# EAGLE design numitron-clock (EAGLE 9.6.2)
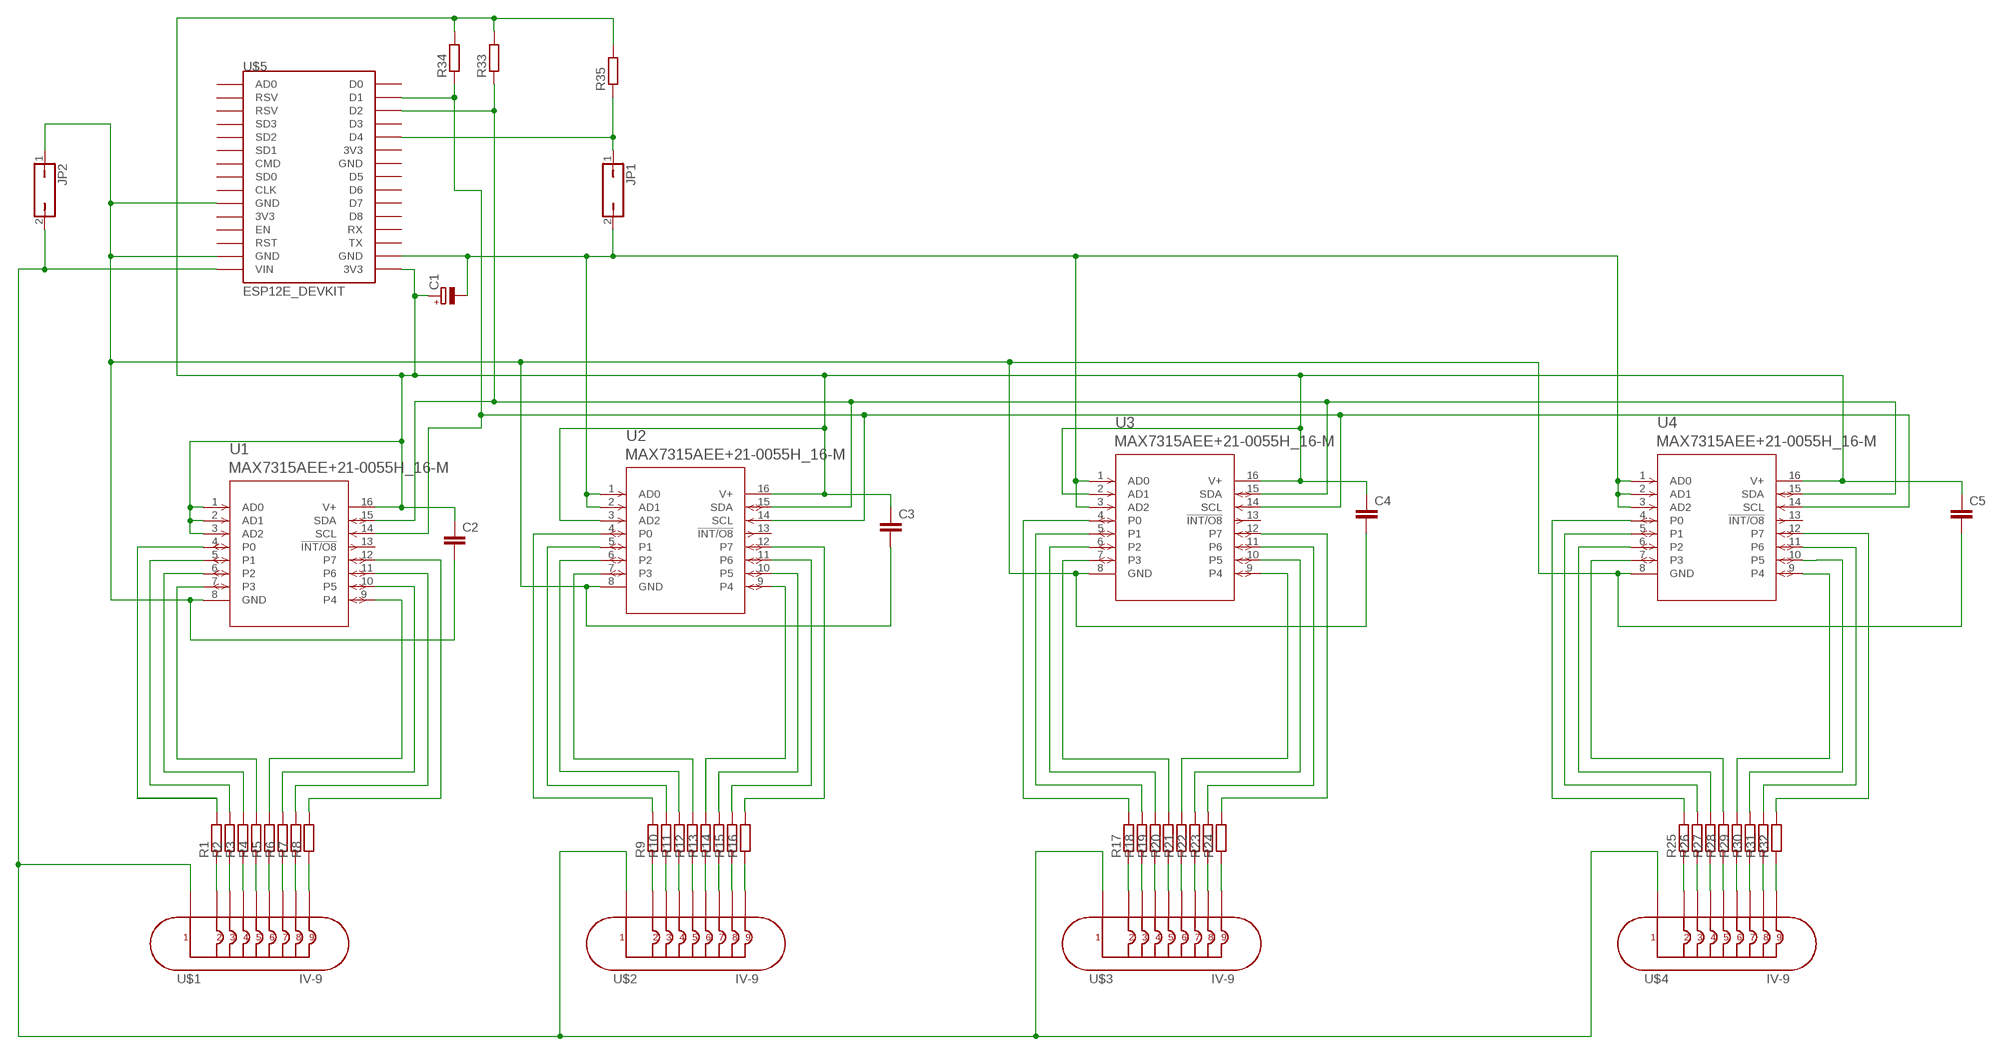
[diagram p0: schematic, sheet 1]

## Parts
C1  CPOL-EUE2,5-6E  [E2,5-6E]
C2  C-EUC0603  [C0603]
C3  C-EUC0603  [C0603]
C4  C-EUC0603  [C0603]
C5  C-EUC0603  [C0603]
JP1  JP1Q  [JP1]
JP2  JP1Q  [JP1]
R1  R-EU_R0603  [R0603]
R2  R-EU_R0603  [R0603]
R3  R-EU_R0603  [R0603]
R4  R-EU_R0603  [R0603]
R5  R-EU_R0603  [R0603]
R6  R-EU_R0603  [R0603]
R7  R-EU_R0603  [R0603]
R8  R-EU_R0603  [R0603]
R9  R-EU_R0603  [R0603]
R10  R-EU_R0603  [R0603]
R11  R-EU_R0603  [R0603]
R12  R-EU_R0603  [R0603]
R13  R-EU_R0603  [R0603]
R14  R-EU_R0603  [R0603]
R15  R-EU_R0603  [R0603]
R16  R-EU_R0603  [R0603]
R17  R-EU_R0603  [R0603]
R18  R-EU_R0603  [R0603]
R19  R-EU_R0603  [R0603]
R20  R-EU_R0603  [R0603]
R21  R-EU_R0603  [R0603]
R22  R-EU_R0603  [R0603]
R23  R-EU_R0603  [R0603]
R24  R-EU_R0603  [R0603]
R25  R-EU_R0603  [R0603]
R26  R-EU_R0603  [R0603]
R27  R-EU_R0603  [R0603]
R28  R-EU_R0603  [R0603]
R29  R-EU_R0603  [R0603]
R30  R-EU_R0603  [R0603]
R31  R-EU_R0603  [R0603]
R32  R-EU_R0603  [R0603]
R33  R-EU_R0603  [R0603]
R34  R-EU_R0603  [R0603]
R35  R-EU_R0603  [R0603]
U1  MAX7315AEE+21-0055H_16-M  [21-0055H_16-M]
U2  MAX7315AEE+21-0055H_16-M  [21-0055H_16-M]
U3  MAX7315AEE+21-0055H_16-M  [21-0055H_16-M]
U4  MAX7315AEE+21-0055H_16-M  [21-0055H_16-M]
U$1  IV-9  [IV-9]
U$2  IV-9  [IV-9]
U$3  IV-9  [IV-9]
U$4  IV-9  [IV-9]
U$5  ESP12E_DEVKIT  [ESP12E_DEVKIT]

## Nets
N$1 [Numitron]: R1.1 U$1.2
N$2 [Numitron]: R2.1 U$1.3
N$3 [Numitron]: R3.1 U$1.4
N$4 [Numitron]: R4.1 U$1.5
N$5 [Numitron]: R5.1 U$1.6
N$6 [Numitron]: R6.1 U$1.7
N$7 [Numitron]: R7.1 U$1.8
N$8 [Numitron]: R8.1 U$1.9
N$9: R1.2 U1.4(P0)
N$11: R33.1 U1.15(SDA) U2.15(SDA) U3.15(SDA) U4.15(SDA) U$5.D2
N$12: R34.1 U1.14(SCL) U2.14(SCL) U3.14(SCL) U4.14(SCL) U$5.D1
N$13 [Numitron]: R2.2 U1.5(P1)
N$14 [V+]: JP2.2 U$1.1 U$2.1 U$3.1 U$4.1 U$5.VIN
N$15 [Numitron]: R3.2 U1.6(P2)
N$16 [Numitron]: R4.2 U1.7(P3)
N$17 [Numitron]: R5.2 U1.9(P4)
N$18 [V+ MAX]: C1.+ C2.1 C3.1 C4.1 C5.1 R33.2 R34.2 R35.2 U1.1(AD0) U1.2(AD1) U1.3(AD2) U1.16(V+) U2.3(AD2) U2.16(V+) U3.2(AD1) U3.16(V+) U4.16(V+) U$5.3V3@2(3V3)
N$19 [Numitron]: R6.2 U1.10(P5)
N$20 [Numitron]: R7.2 U1.11(P6)
N$21 [Numitron]: R8.2 U1.12(P7)
N$22 [Numitron]: R12.2 U2.7(P3)
N$23 [Numitron]: R11.2 U2.6(P2)
N$24 [Numitron]: R10.2 U2.5(P1)
N$25 [Numitron]: R9.2 U2.4(P0)
N$26 [Numitron]: R13.2 U2.9(P4)
N$27 [Numitron]: R14.2 U2.10(P5)
N$28 [Numitron]: R15.2 U2.11(P6)
N$29 [Numitron]: R16.2 U2.12(P7)
N$30 [Numitron]: R17.2 U3.4(P0)
N$31 [Numitron]: R18.2 U3.5(P1)
N$32 [Numitron]: R19.2 U3.6(P2)
N$33 [Numitron]: R20.2 U3.7(P3)
N$34 [Numitron]: R21.2 U3.9(P4)
N$35 [Numitron]: R22.2 U3.10(P5)
N$36 [Numitron]: R23.2 U3.11(P6)
N$37 [Numitron]: R24.2 U3.12(P7)
N$38 [Numitron]: R25.2 U4.4(P0)
N$39 [Numitron]: R26.2 U4.5(P1)
N$40 [Numitron]: R27.2 U4.6(P2)
N$41 [Numitron]: R28.2 U4.7(P3)
N$42 [Numitron]: R29.2 U4.9(P4)
N$43 [Numitron]: R30.2 U4.10(P5)
N$44 [Numitron]: R31.2 U4.11(P6)
N$45 [Numitron]: R32.2 U4.12(P7)
N$46: JP1.1 R35.1 U$5.D4
N$48 [GND]: C2.2 C3.2 C4.2 C5.2 JP2.1 U1.8(GND) U2.8(GND) U3.8(GND) U4.8(GND) U$5.GND@0(GND) U$5.GND@1(GND)
N$50: C1.- JP1.2 U2.1(AD0) U2.2(AD1) U3.1(AD0) U3.3(AD2) U4.1(AD0) U4.2(AD1) U4.3(AD2) U$5.GND@3(GND)
N$51 [Numitron]: R25.1 U$4.2
N$52 [Numitron]: R26.1 U$4.3
N$53 [Numitron]: R27.1 U$4.4
N$54 [Numitron]: R28.1 U$4.5
N$55 [Numitron]: R29.1 U$4.6
N$56 [Numitron]: R30.1 U$4.7
N$57 [Numitron]: R31.1 U$4.8
N$58 [Numitron]: R32.1 U$4.9
N$59 [Numitron]: R17.1 U$3.2
N$60 [Numitron]: R18.1 U$3.3
N$61 [Numitron]: R19.1 U$3.4
N$62 [Numitron]: R20.1 U$3.5
N$63 [Numitron]: R21.1 U$3.6
N$64 [Numitron]: R22.1 U$3.7
N$65 [Numitron]: R23.1 U$3.8
N$66 [Numitron]: R24.1 U$3.9
N$67 [Numitron]: R9.1 U$2.2
N$68 [Numitron]: R10.1 U$2.3
N$69 [Numitron]: R11.1 U$2.4
N$70 [Numitron]: R12.1 U$2.5
N$71 [Numitron]: R13.1 U$2.6
N$72 [Numitron]: R14.1 U$2.7
N$73 [Numitron]: R15.1 U$2.8
N$74 [Numitron]: R16.1 U$2.9
Unconnected: U1.13(!INT/O8) U2.13(!INT/O8) U3.13(!INT/O8) U4.13(!INT/O8) U$5.3V3@0(3V3) U$5.3V3@1(3V3) U$5.AD0 U$5.CLK U$5.CMD U$5.D0 U$5.D3 U$5.D5 U$5.D6 U$5.D7 U$5.D8 U$5.EN U$5.GND@2(GND) U$5.RST U$5.RSV@0(RSV) U$5.RSV@1(RSV) U$5.RX U$5.SD0 U$5.SD1 U$5.SD2 U$5.SD3 U$5.TX

## Library data of the parts
C1 = rcl:CPOL-EU: POLARIZED CAPACITOR, European symbol; SPICEPREFIX: C
C2-C5 = rcl:C-EU: CAPACITOR, European symbol; SPICEPREFIX: C
JP1 JP2 = jumper:JP1Q: JUMPER
R1-R35 = rcl:R-EU_: RESISTOR, European symbol; SPICEPREFIX: R
U1-U4 = MAX7315:MAX7315AEE+; COPYRIGHT: Copyright (C) 2024 Ultra Librarian. All rights reserved.; MANUFACTURER_PART_NUMBER: MAX7315AEE+; MFR_NAME: Analog Devices Inc
U$1-U$4 = domestichacks:IV-9
U$5 = ESP12E_DEVKIT:ESP12E_DEVKIT: ESP12E DEVKIT BOARD

## Net classes
0 default: width 0.3 mm
1 V+: width 0.6 mm
2 Numitron: width 0.3 mm
3 GND: width 0.6 mm
4 V+ MAX: width 0.3 mm

## Board
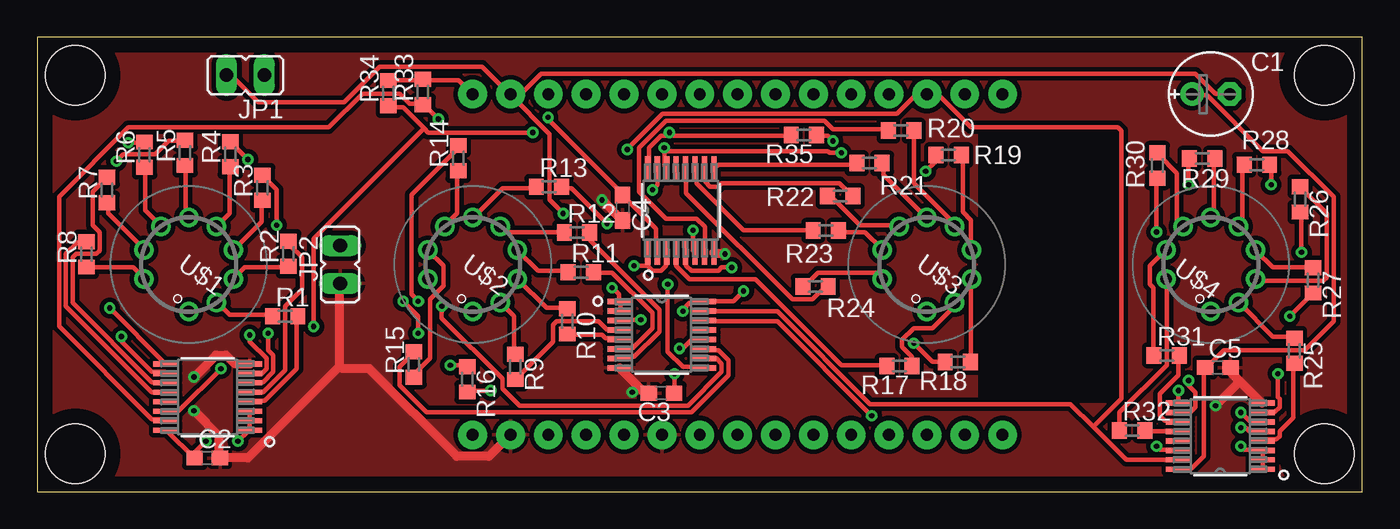
[diagram p1: board, top side]
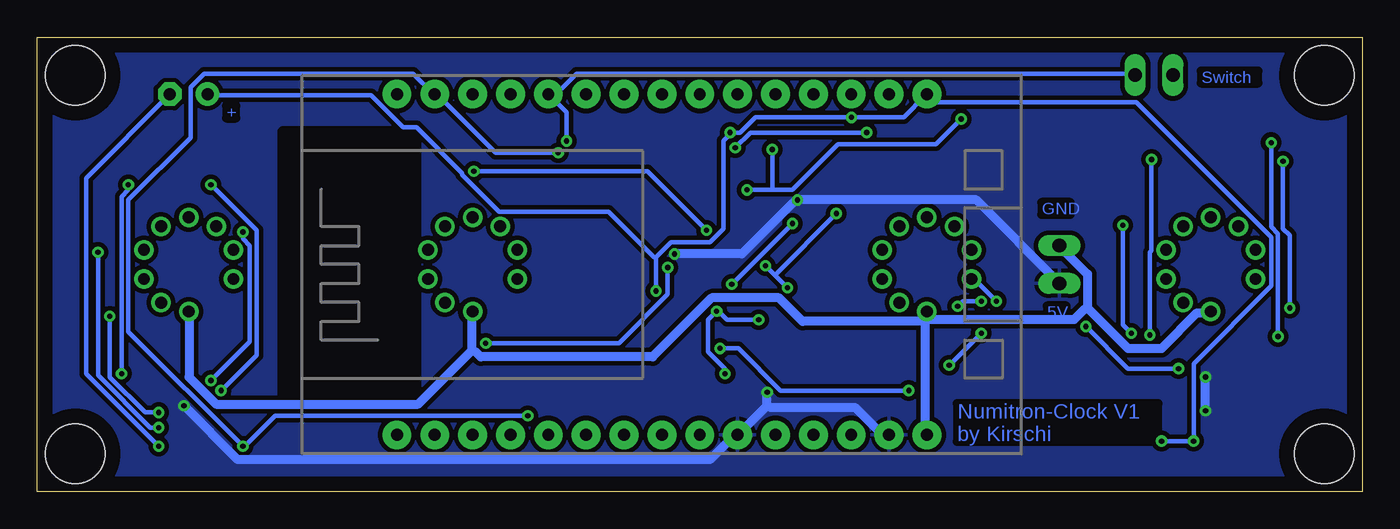
[diagram p2: board, bottom side, seen from below]

Size 88.9 x 30.48 mm. Coordinates in mm from the lower left corner, seen from the top.
Outline: 0,0 88.9,0 88.9,30.48 0,30.47 0,0
Copper layers (1*16): Top 0.035mm / dielectric 1.5mm / Bottom 0.035mm
Design rules "default": minimum track width 6mil, minimum drill 0.35mm, track to track 6mil, track to pad 6mil, pad to pad 6mil, via to via 6mil, smd to smd 6mil, copper to edge 40mil, drill to drill 6mil, minimum pad ring 10mil, minimum via ring 8mil, stop-mask expansion 4mil, vias tented up to drill 0mil, thermal gap 10mil
Holes 4 mm at 2.54,2.54 2.54,27.94 86.36,27.94 86.36,2.54
tRestrict: area 63.5,6.3 to 72.4,24.1
bRestrict: area 63.5,6.3 to 72.4,24.1

### Footprints (pad centres in the part's own frame; a part is rotated, then mirrored left to right if it is on the bottom)
E2,5-6E = drill 0.813 pad 1.575: + -1.27,0 | drill 0.813 pad 1.575 octagon: - 1.27,0
C0603 = smd 1.1 x 1: 1 -0.85,0; 2 0.85,0
JP1 = drill 0.914 long: 1 0,-1.27; 2 0,1.27
R0603 = smd 1 x 1.1: 1 -0.85,0; 2 0.85,0
21-0055H_16-M = smd 1.655 x 0.355: 1 -2.821,2.223; 2 -2.821,1.587; 3 -2.821,0.953; 4 -2.821,0.318; 5 -2.821,-0.318; 6 -2.821,-0.953; 7 -2.821,-1.587; 8 -2.821,-2.223; 9 2.821,-2.223; 10 2.821,-1.587; 11 2.821,-0.953; 12 2.821,-0.318; 13 2.821,0.318; 14 2.821,0.953; 15 2.821,1.587; 16 2.821,2.223
IV-9 = drill 0.8: 1 1.854,-2.552; 2 3,-0.975; 3 3,0.975; 4 1.854,2.552; 5 0,3.154; 6 -1.854,2.552; 7 -3,0.975; 8 -3,-0.975; 9 -1.854,-2.552
ESP12E_DEVKIT = drill 0.8 pad 1.93: 3V3@0 -11.43,-7.62; 3V3@1 11.43,5.08; 3V3@2 11.43,-17.78; AD0 -11.43,17.78; CLK -11.43,-2.54; CMD -11.43,2.54; D0 11.43,17.78; D1 11.43,15.24; D2 11.43,12.7; D3 11.43,10.16; D4 11.43,7.62; D5 11.43,0; D6 11.43,-2.54; D7 11.43,-5.08; D8 11.43,-7.62; EN -11.43,-10.16; GND@0 -11.43,-5.08; GND@1 -11.43,-15.24; GND@2 11.43,2.54; GND@3 11.43,-15.24; RST -11.43,-12.7; RSV@0 -11.43,15.24; RSV@1 -11.43,12.7; RX 11.43,-10.16; SD0 -11.43,0; SD1 -11.43,5.08; SD2 -11.43,7.62; SD3 -11.43,10.16; TX 11.43,-12.7; VIN -11.43,-17.78

### Placement (x,y rotation side)
C1  78.74,26.67 0 top
C2  11.41,2.26 0 top
C3  41.88,6.62 180 top
C4  39.28,19.05 270 top
C5  79.21,8.33 0 top
JP1  13.97,27.94 90 top
JP2  20.32,15.24 0 top
R1  16.64,11.77 0 top
R2  16.86,15.96 90 top
R3  15.11,20.39 90 top
R4  12.95,22.63 90 top
R5  9.92,22.73 90 top
R6  7.2,22.6 90 top
R7  4.69,20.24 90 top
R8  3.29,15.92 90 top
R9  32.08,8.38 270 top
R10  35.56,11.43 270 top
R11  36.48,14.72 0 top
R12  36.21,17.39 0 top
R13  34.34,20.45 0 top
R14  28.24,22.37 90 top
R15  25.27,8.53 90 top
R16  28.84,7.54 270 top
R17  57.85,8.42 180 top
R18  61.77,8.7 180 top
R19  61.15,22.58 180 top
R20  57.96,24.22 180 top
R21  55.84,22.04 180 top
R22  53.87,19.83 0 top
R23  52.91,17.52 180 top
R24  52.22,13.77 0 top
R25  84.34,9.45 270 top
R26  84.73,19.61 270 top
R27  85.61,14.18 270 top
R28  81.83,21.93 0 top
R29  78.16,22.35 180 top
R30  75.15,21.88 270 top
R31  75.78,9.14 0 top
R32  73.46,4.11 0 top
R33  25.88,26.81 90 top
R34  23.57,26.73 90 top
R35  51.44,23.92 180 top
U1  11.43,6.35 180 top
U2  41.9,10.53 0 top
U3  43.18,18.87 90 top
U4  79.37,3.73 180 top
U$1  10.16,15.24 324 top
U$2  29.21,15.24 324 top
U$3  59.69,15.24 324 top
U$4  78.74,15.24 324 top
U$5  46.99,15.24 90 bottom

### Tracks (layer width: path | path; a pad name or v marks a point on that pad's centre or on a via)
N$1
  Top 0.3: R1.1 15.72,11.88 12.89,11.88 12.1,12.67 U$1.2
N$2
  Top 0.3: R2.1 16.85,15.04 13.91,15.04 13.23,14.36 U$1.3
N$3
  Top 0.3: R3.1 15.04,19.45 15.04,18.1 13.23,16.29 U$1.4
N$4
  Top 0.3: R4.1 12.89,21.71 12.89,18.66 12.1,17.87 U$1.5
N$5
  Top 0.3: R5.1 9.95,21.83 9.95,18.55 10.07,18.43 U$1.6
N$6
  Top 0.3: R6.1 7.24,21.71 7.24,18.89 8.26,17.87 U$1.7
N$7
  Top 0.3: R7.1 4.75,19.34 4.75,18.66 7.12,16.29 U$1.8
N$8
  Top 0.3: R8.1 3.39,15.04 6.45,15.04 7.12,14.36 U$1.9
N$9
  Top 0.3: R1.2 17.42,11.76 17.42,8.26 15.27,6.11 14.36,6.11 U1.4
N$11  (via drill 0.35)
  Top 0.3: 70.86,4.35 73.06,2.15 76.46,2.15 U4.15 | 70.86,4.35 69.33,5.88 55.87,5.88 49.65,12.1 44.79,12.1 U2.15 | 70.86,4.35 72.72,6.22 72.72,24.2 72.5,24.43 62.66,24.43 60.51,26.58 59.72,26.58 U$5.D2 59.6,26.58 58.92,26.58 57.68,25.33 41.96,25.33 v39.59,22.96 | U1.15 8.6,4.86 7.69,4.86 1.47,11.08 1.47,19.79 6.11,24.43 19.57,24.43 21.83,26.69 24.32,26.69 25,26.01 25.79,26.01 R33.1 26.01,25.9 v26.92,25 | v41.28,20.25 41.62,20.58 41.62,21.6 U3.15
  Bottom 0.3: 39.59,20.25 38.23,20.25 35.17,23.3 28.61,23.3 v26.92,25 | 39.59,20.25 v41.28,20.25 | 39.59,20.25 v39.59,22.96
N$12  (via drill 0.35)
  Top 0.3: 25.96,24.37 26.24,24.09 v33.25,24.09 | 25.96,24.37 24.54,25.79 23.64,25.79 R34.1 | U3.14 42.19,21.71 42.07,21.83 v42.07,23.07 42.19,22.85 53.04,22.85 53.16,22.73 v53.95,22.73 | v12.33,8.26 9.5,5.43 8.71,5.43 U1.14 | v18.55,11.08 18.55,16.96 25.96,24.37 | v75.1,3.05 75.33,2.83 76.46,2.83 U4.14 | v55.98,5.09 49.65,11.42 44.79,11.42 U2.14
  Bottom 0.3: v33.25,24.09 41.05,24.09 v42.07,23.07 | v12.33,8.26 15.72,8.26 v18.55,11.08 | v55.98,5.09 72.95,5.09 74.98,3.05 v75.1,3.05 82.79,10.74 82.79,19.57 78.61,23.75 78.61,27.14 77.7,28.05 63.67,28.05 62.32,26.69 U$5.D1 62.09,26.69 58.13,22.73 v53.95,22.73
N$13
  Top 0.3: R2.2 16.96,16.74 16.96,16.51 17.76,15.72 17.76,13.57 16.63,12.44 16.63,8.14 15.15,6.67 14.36,6.67 U1.5
N$14
  Bottom 0.6: 59.72,9.5 59.72,11.99 U$3.1 | 59.72,9.5 63.34,5.88 76.91,5.88 78.72,7.69 78.72,11.99 U$4.1 | 29.29,11.42 29.29,3.85 U$5.VIN | 29.29,11.42 29.29,11.99 U$2.1 29.07,11.54 19.34,11.54 18.66,12.21 18.43,12.33 | 18.43,12.33 15.72,9.61 13.46,9.61 11.08,11.99 10.18,11.99 U$1.1 | 18.43,12.33 18.43,14.59 20.25,16.4 JP2.2 | 29.29,11.42 37.55,11.42 39.13,13.01 43.66,13.01 47.62,9.05 59.15,9.05 59.49,9.39 59.72,9.5
N$15  (via drill 0.35)
  Top 0.3: v16.06,17.87 16.06,20.25 15.15,21.15 R3.2 | v15.49,10.63 15.49,9.5 15.83,9.16 15.83,8.03 15.15,7.35 14.36,7.35 U1.6
  Bottom 0.3: v16.06,17.87 16.06,11.2 v15.49,10.63
N$16  (via drill 0.35)
  Top 0.3: v14.14,22.28 13.01,23.41 R4.2 | v14.25,10.52 14.25,10.07 15.38,8.94 15.38,8.26 15.04,7.92 14.36,7.92 U1.7
  Bottom 0.3: v14.14,22.28 14.14,16.17 14.25,16.06 v14.25,10.52
N$17  (via drill 0.35)
  Top 0.3: v5.32,22.17 5.77,22.62 7.92,22.62 8.82,23.52 9.84,23.52 R5.2 | v4.86,12.33 8.6,8.6 U1.9
  Bottom 0.3: v5.32,22.17 5.32,17.64 4.86,17.19 v4.86,12.33
N$18  (via drill 0.35)
  Top 0.3: U4.16 76.57,1.58 77.47,1.58 78.27,2.38 78.27,8.26 C5.1 78.49,8.37 79.62,9.5 85.05,9.5 86.97,11.42 86.97,19.79 83.92,22.85 82.22,22.85 78.49,26.58 77.47,26.58 C1.+ | v42.75,7.92 42.75,6.67 C3.1 | v43.32,12.1 43.54,12.33 43.54,12.44 43.77,12.67 44.67,12.67 U2.16 44.79,12.78 46.71,12.78 v47.39,13.46 | v40.49,11.54 39.13,11.54 U2.3 | 42.41,23.86 41.85,23.86 41.05,23.07 41.05,21.71 U3.16 | 42.41,23.86 50.56,23.86 R35.2 | U1.3 14.25,5.32 14.25,4.86 U1.2 14.25,4.18 U1.1 14.14,4.07 v13.46,3.39 | U1.16 8.71,4.07 10.52,2.26 C2.1 10.4,2.49 v11.31,3.39 | U3.2 41.51,16.06 41.51,17.64 39.36,19.79 C4.1 39.25,20.02 34.27,25 v34.27,25.11 | R34.2 23.64,27.6 25.79,27.6 R33.2 26.01,27.6 28.27,27.6 29.18,26.69 U$5.3V3@2 | v42.41,24.09 42.41,23.86
  Bottom 0.3: v42.75,7.92 42.75,8.26 43.88,9.39 43.88,11.54 v43.32,12.1 43.2,12.1 42.64,11.54 v40.49,11.54 | v13.46,3.39 v11.31,3.39 11.31,8.6 6.11,13.8 6.11,17.08 15.15,26.13 28.5,26.13 29.07,26.69 U$5.3V3@2 29.29,26.58 30.76,25.11 v34.27,25.11 40.72,25.11 41.73,24.09 v42.41,24.09 42.41,23.98 42.87,23.52 42.87,17.64 43.77,16.74 46.37,16.74 47.39,15.72 | 47.39,15.72 v47.39,13.46 | C1.+ 77.36,26.58 66.5,26.58 64.35,24.43 63.45,24.43 60.4,21.38 60.4,21.26 57.91,18.77 50.56,18.77 47.5,15.72 47.39,15.72
N$19  (via drill 0.35)
  Top 0.3: v6.11,23.41 7.12,23.41 R6.2 | v5.66,10.4 5.66,10.07 7.69,8.03 8.6,8.03 U1.10
  Bottom 0.3: v6.11,23.41 6.11,17.76 5.66,17.3 v5.66,10.4
N$20
  Top 0.3: R7.2 4.64,21.04 3.73,20.13 3.73,17.87 4.18,17.42 4.18,16.17 3.96,15.95 2.6,15.95 2.38,15.72 2.38,12.67 7.69,7.35 8.6,7.35 U1.11
N$21
  Top 0.3: R8.2 3.28,16.74 2.71,16.74 1.92,15.95 1.92,12.44 7.69,6.67 8.6,6.67 U1.12
N$22
  Top 0.3: R12.2 37.1,17.3 37.1,16.85 41.73,12.21 41.73,10.74 40.04,9.05 39.13,9.05 U2.7
N$23
  Top 0.3: R11.2 37.44,14.7 38.57,14.7 41.28,11.99 41.28,10.97 39.92,9.61 39.13,9.61 U2.6
N$24
  Top 0.3: R10.2 35.63,10.52 37.89,10.52 38.12,10.29 39.02,10.29 U2.5
N$25
  Top 0.3: R9.2 32.12,7.58 34.61,10.07 34.61,11.2 34.84,11.42 37.66,11.42 38.23,10.86 39.02,10.86 U2.4
N$26  (via drill 0.35)
  Top 0.3: v38.23,17.98 35.85,20.36 35.29,20.36 R13.2 | v42.3,13.91 42.3,9.39 43.32,8.37 44.67,8.37 U2.9
  Bottom 0.3: v42.3,13.91 v38.23,17.98
N$27  (via drill 0.35)
  Top 0.3: v25.56,12.78 25.11,13.23 25.11,19.91 28.16,22.96 28.16,23.19 R14.2 | v27.14,12.44 27.14,11.65 31.22,7.58 31.22,6.9 32.35,5.77 43.66,5.77 45.92,8.03 45.92,8.6 45.58,8.94 44.79,8.94 U2.10
  Bottom 0.3: v25.56,12.78 26.8,12.78 v27.14,12.44
N$28
  Top 0.3: R15.2 25.22,9.27 24.32,8.37 24.32,7.12 26.13,5.32 43.88,5.32 46.37,7.8 46.37,8.82 45.69,9.5 44.79,9.5 U2.11
N$29  (via drill 0.35)
  Top 0.3: v30.42,6.79 28.95,6.79 R16.2 | v43.09,9.61 43.32,9.61 43.88,10.18 44.67,10.18 U2.12
  Bottom 0.3: v30.42,6.79 39.02,6.79 41.85,9.61 v43.09,9.61
N$30
  Top 0.3: R17.2 56.89,8.48 53.95,8.48 48.18,14.25 43.77,14.25 42.87,15.15 42.87,15.95 U3.4
N$31  (via drill 0.35)
  Top 0.3: v58.81,9.95 60.06,8.71 60.85,8.71 R18.2 | v46.6,15.04 45.92,15.04 45.69,14.82 43.88,14.82 43.54,15.15 43.54,15.95 U3.5
  Bottom 0.3: v58.81,9.95 49.88,9.95 46.6,13.23 v46.6,15.04
N$32  (via drill 0.35)
  Top 0.3: v59.6,21.49 60.28,22.17 60.28,22.51 R19.2 | v44,17.53 44,16.17 44.11,16.06 U3.6
  Bottom 0.3: v59.6,21.49 47.95,21.49 v44,17.53
N$33
  Top 0.3: R20.2 57,24.32 53.38,24.32 52.82,24.88 42.19,24.88 40.38,23.07 40.38,20.13 42.19,18.32 44.22,18.32 44.79,17.76 44.79,16.06 U3.7
N$34
  Top 0.3: R21.2 54.97,21.94 45.69,21.94 45.47,21.71 U3.9
N$35
  Top 0.3: R22.2 54.63,19.91 53.84,20.7 45.92,20.7 45.69,20.47 45.13,20.47 44.79,20.81 44.79,21.6 U3.10
N$36
  Top 0.3: R23.2 52.03,17.53 47.39,17.53 44.22,20.7 44.22,21.6 U3.11
N$37
  Top 0.3: R24.2 53.04,13.69 52.82,13.69 52.03,12.89 50.67,12.89 43.54,20.02 43.54,21.6 U3.12
N$38
  Top 0.3: R25.2 84.26,8.6 84.26,4.98 83.36,4.07 83.36,3.73 83.13,3.51 82.22,3.51 U4.4
N$39  (via drill 0.35)
  Top 0.3: v84.83,16.06 84.83,18.66 R26.2 | v80.75,4.3 81.09,4.3 81.32,4.07 82.11,4.07 U4.5
  Bottom 0.3: v84.83,16.06 84.83,7.8 81.32,4.3 v80.75,4.3
N$40  (via drill 0.35)
  Top 0.3: v84.03,11.76 85.5,13.23 R27.2 | v80.75,5.32 81.32,4.75 82.11,4.75 U4.6
  Bottom 0.3: v84.03,11.76 84.03,7.69 81.66,5.32 v80.75,5.32
N$41  (via drill 0.35)
  Top 0.3: v82.79,20.58 82.79,21.83 R28.2 | v83.24,7.92 83.24,6.33 83.36,6.22 83.36,5.66 83.02,5.32 82.22,5.32 U4.7
  Bottom 0.3: v82.79,20.58 82.79,20.25 83.24,19.79 v83.24,7.92
N$42  (via drill 0.35)
  Top 0.3: v77.25,20.58 77.25,22.28 R29.2 | v76.57,6.79 76.57,5.99 U4.9
  Bottom 0.3: v77.25,20.58 74.19,17.53 74.19,9.16 v76.57,6.79
N$43  (via drill 0.35)
  Top 0.3: v75.1,17.42 75.1,20.92 R30.2 | v77.25,7.46 77.25,7.12 77.7,6.67 77.7,5.66 77.36,5.32 76.57,5.32 U4.10
  Bottom 0.3: v75.1,17.42 75.1,16.96 74.65,16.51 74.65,10.07 v77.25,7.46
N$44
  Top 0.3: R31.2 76.57,9.05 76.57,7.8 75.33,6.56 75.33,5.09 75.66,4.75 76.46,4.75 U4.11
N$45
  Top 0.3: R32.2 74.42,4.07 76.46,4.07 U4.12
N$46  (via drill 0.35)
  Top 0.3: v53.38,23.52 53.04,23.86 52.37,23.86 R35.1
  Bottom 0.3: v53.38,23.52 53.38,25.45 54.51,26.58 U$5.D4 54.29,26.46 52.7,28.05 15.27,28.05 JP1.1
N$48  (via drill 0.35)
  Top 0.6: 20.25,8.37 14.14,2.26 12.33,2.26 C2.2 12.21,2.49 12.21,3.73 v10.52,5.43 | 20.25,8.37 20.25,13.91 JP2.1 | v37.89,19.57 39.25,18.21 C4.2 | v10.52,7.69 11.99,9.16 12.67,9.16 13.23,8.6 14.25,8.6 U1.8 | v46.15,15.95 45.47,15.95 U3.8 | 80.7,7.41 82.11,5.99 U4.8 | 80.7,7.41 80.08,8.03 80.08,8.26 C5.2 | 40.32,7.07 39.13,8.26 U2.8 | 40.32,7.07 40.72,6.67 40.94,6.67 C3.2 | v39.92,6.67 40.32,7.07 | v79.06,5.77 80.7,7.41 | 20.25,8.37 20.47,8.26 22.28,8.26 28.16,2.38 30.31,2.38 31.67,3.73 U$5.GND@1
  Bottom 0.6: JP2.1 20.36,14.02 25.9,19.57 v37.89,19.57 38.12,19.45 41.62,15.95 v46.15,15.95 | v10.52,5.43 v10.52,7.69 | 39.92,5.77 v39.92,6.67 | 39.92,5.77 41.85,3.85 U$5.GND@0 42.19,3.73 43.77,2.15 75.44,2.15 v79.06,5.77 | U$5.GND@1 31.78,3.85 32.23,3.85 34.04,5.66 39.7,5.66 39.92,5.77
  pour Top (isolate 0.305): 0,30.48 0,0 88.9,0 88.9,30.48
  pour Bottom (isolate 0.305): 0,0 0,30.48 88.9,30.48 88.9,0
N$50  (via drill 0.35)
  Top 0.3: U4.1 82.22,1.58 82.22,2.04 U4.2 82.22,2.26 82.22,2.71 U4.3 82.11,2.83 80.98,2.83 v80.75,3.05 | U2.2 39.13,12.21 39.13,12.67 U2.1 39.02,12.89 39.02,13.23 v38.57,13.69 | 40.94,15.15 40.94,15.95 U3.1 | 40.94,15.15 41.28,14.82 41.85,14.82 42.19,15.15 42.19,15.95 U3.3 | 40.94,15.15 v40.04,15.15 | JP1.2 12.78,27.94 13.01,27.94 14.82,26.13 20.58,26.13 22.96,28.5 29.86,28.5 31.67,26.69 U$5.GND@3 | v35.29,18.66 34.38,19.57 34.38,23.98 31.78,26.58 U$5.GND@3 | C1.- 79.96,26.69 79.06,26.69 77.7,28.05 33.82,28.05 32.12,26.35 U$5.GND@3
  Bottom 0.3: v80.75,3.05 85.62,7.92 85.62,21.04 80.08,26.58 C1.- | v40.04,15.15 39.41,14.53 | 39.41,14.53 v38.57,13.69 | v35.29,18.66 39.41,14.53
N$51
  Top 0.3: R25.1 84.26,10.4 82.9,10.4 80.64,12.67 U$4.2
N$52
  Top 0.3: R26.1 84.83,20.36 86.52,18.66 86.52,14.36 86.3,14.14 81.88,14.14 81.77,14.25 U$4.3
N$53
  Top 0.3: R27.1 85.5,15.04 82.9,15.04 81.77,16.17 U$4.4
N$54
  Top 0.3: R28.1 80.87,21.83 80.87,18.1 80.64,17.87 U$4.5
N$55
  Top 0.3: R29.1 78.94,22.28 78.94,18.55 78.83,18.43 U$4.6
N$56
  Top 0.3: R30.1 75.21,22.62 76.46,21.38 76.46,18.21 76.8,17.87 U$4.7
N$57
  Top 0.3: R31.1 74.87,9.16 74.87,13.69 74.65,13.91 74.65,15.15 75.66,16.17 U$4.8
N$58
  Top 0.3: R32.1 72.61,4.18 72.61,5.32 75.78,8.48 75.78,14.25 U$4.9
N$59
  Top 0.3: R17.1 58.7,8.48 58.7,9.05 58.02,9.73 58.02,10.18 58.81,10.97 60.06,10.97 61.53,12.44 61.53,12.67 U$3.2
N$60
  Top 0.3: R18.1 62.66,8.71 62.66,14.25 U$3.3
N$61
  Top 0.3: R19.1 62.09,22.51 62.09,18.77 62.66,18.21 62.66,16.29 U$3.4
N$62
  Top 0.3: R20.1 58.81,24.2 58.81,20.7 61.64,17.87 U$3.5
N$63
  Top 0.3: R21.1 56.78,21.94 56.78,21.26 59.6,18.43 U$3.6
N$64
  Top 0.3: R22.1 53.04,19.79 53.27,19.79 55.19,17.87 57.79,17.87 U$3.7
N$65
  Top 0.3: R23.1 53.84,17.42 55.53,17.42 56.66,16.29 U$3.8
N$66
  Top 0.3: R24.1 51.46,13.8 52.37,14.7 56.32,14.7 56.66,14.36 U$3.9
N$67
  Top 0.3: R9.1 32.01,9.27 32.01,11.76 31.1,12.67 U$2.2
N$68
  Top 0.3: R10.1 35.51,12.33 34.16,12.33 32.23,14.25 U$2.3
N$69
  Top 0.3: R11.1 35.51,14.82 33.59,14.82 32.23,16.17 U$2.4
N$70
  Top 0.3: R12.1 35.29,17.42 31.44,17.42 31.1,17.76 U$2.5
N$71
  Top 0.3: R13.1 33.48,20.36 31.22,20.36 29.29,18.43 U$2.6
N$72
  Top 0.3: R14.1 28.16,21.49 28.16,18.66 27.37,17.87 U$2.7
N$73
  Top 0.3: R15.1 25.33,7.69 25.33,7.92 26.35,8.94 26.35,12.89 27.26,13.8 27.26,15.15 26.24,16.17 U$2.8
N$74  (via drill 0.35)
  Top 0.3: v27.71,8.48 28.84,8.48 R16.1 | v25.56,10.63 25.56,11.76 v24.54,12.78
  Bottom 0.3: v25.56,10.63 v27.71,8.48 | v24.54,12.78 26.13,14.36 U$2.9

### Text on the board
Bottom: Switch | + | GND | 5V | Numitron-Clock V1 / by Kirschi